# Altium schematic sheet Audio_module.SchDoc
size A4
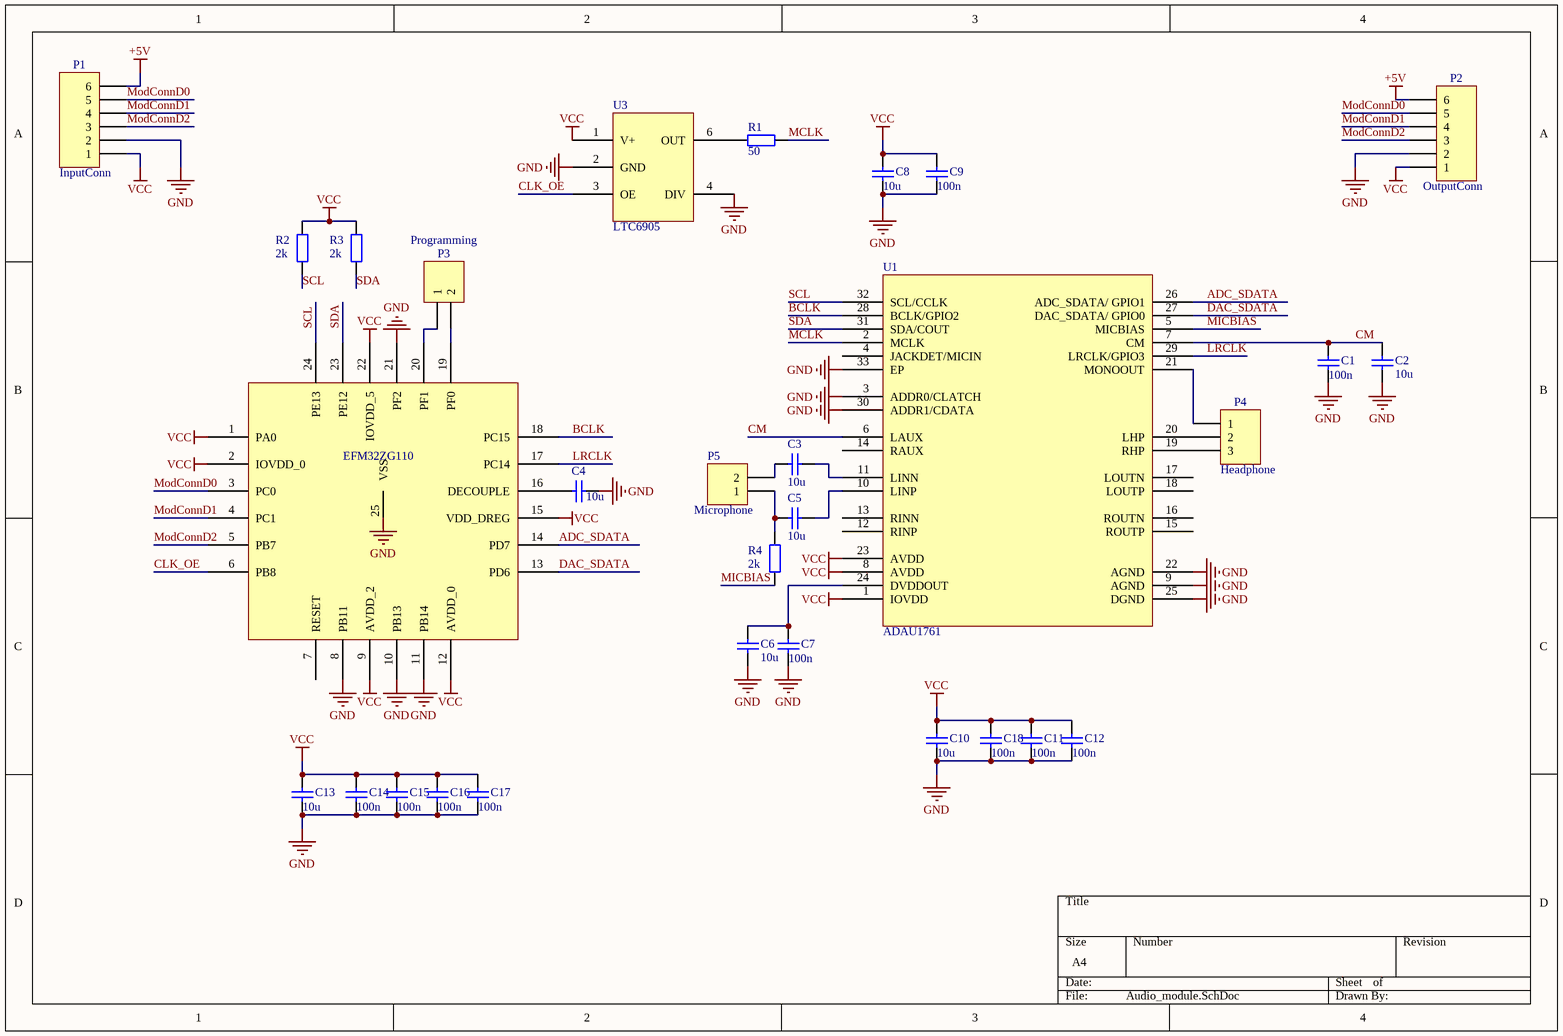
[diagram p0: Audio_module.SchDoc]

## Parts
C1  value 100n  [0402]  (hidden comment: Cap Semi)
C2  10u  [0805]
C3  10u  [0805]
C4  10u  [0805]
C5  10u  [0805]
C6  10u  [0805]
C7  value 100n  [0402]  (hidden comment: Cap Semi)
C8  10u  [0805]
C9  value 100n  [0402]  (hidden comment: Cap Semi)
C10  10u  [0805]
C11  value 100n  [0402]  (hidden comment: Cap Semi)
C12  value 100n  [0402]  (hidden comment: Cap Semi)
C13  10u  [0805]
C14  value 100n  [0402]  (hidden comment: Cap Semi)
C15  value 100n  [0402]  (hidden comment: Cap Semi)
C16  value 100n  [0402]  (hidden comment: Cap Semi)
C17  value 100n  [0402]  (hidden comment: Cap Semi)
C18  value 100n  [0402]  (hidden comment: Cap Semi)
P1  InputConn  [Goldpin6_1.27mm]
P2  OutputConn  [Goldpin6_1.27mm]
P3  Programming  [GeckoProgramming]
P4  Headphone  [3pinConnector]
P5  Microphone  [GeckoProgramming]
R1  value 50  [0402]  (hidden comment: Res2)
R2  value 2k  [0402]  (hidden comment: Res2)
R3  value 2k  [0402]  (hidden comment: Res2)
R4  value 2k  [0402]  (hidden comment: Res2)
U1  ADAU1761  [QFN32]
U2  EFM32ZG110  [QFN24_5x5_0.65]
U3  LTC6905  [SOT23-6_M]

## Nets
+5V: P1.6 P2.6
GND: C1.1 C2.1 C4.1 C6.1 C7.1 C8.1 C9.1 C10.1 C11.1 C12.1 C13.1 C14.1 C15.1 C16.1 C17.1 C18.1 P1.2 P2.2 U1.3(ADDR0/CLATCH) U1.9(AGND) U1.22(AGND) U1.25(DGND) U1.30(ADDR1/CDATA) U1.33(EP) U2.8(PB11) U2.10(PB13) U2.11(PB14) U2.21(PF2) U2.25(VSS) U3.2(GND) U3.4(DIV)
VCC: C8.2 C9.2 C10.2 C11.2 C12.2 C13.2 C14.2 C15.2 C16.2 C17.2 C18.2 P1.1 P2.1 R2.2 R3.2 U1.1(IOVDD) U1.8(AVDD) U1.23(AVDD) U2.1(PA0) U2.2(IOVDD_0) U2.9(AVDD_2) U2.12(AVDD_0) U2.15(VDD_DREG) U2.22(IOVDD_5) U3.1(V+)
ADC_SDATA: U1.26(ADC_SDATA/_GPIO1) U2.14(PD7)
BCLK: U1.28(BCLK/GPIO2) U2.18(PC15)
CLK_OE: U2.6(PB8) U3.3(OE)
CM: C1.2 C2.2 U1.6(LAUX) U1.7(CM)
DAC_SDATA: U1.27(DAC_SDATA/_GPIO0) U2.13(PD6)
LRCLK: U1.29(LRCLK/GPIO3) U2.17(PC14)
MCLK: R1.1 U1.2(MCLK)
MICBIAS: R4.1 U1.5(MICBIAS)
ModConnD0: P1.5 P2.5 U2.3(PC0)
ModConnD1: P1.4 P2.4 U2.4(PC1)
ModConnD2: P1.3 P2.3 U2.5(PB7)
SCL: R2.1 U1.32(SCL/CCLK) U2.24(PE13)
SDA: R3.1 U1.31(SDA/COUT) U2.23(PE12)
NetC3_1: C3.1 U1.11(LINN)
NetC3_2: C3.2 P5.2
NetC4_2: C4.2 U2.16(DECOUPLE)
NetC5_1: C5.1 U1.10(LINP)
NetC5_2: C5.2 P5.1 R4.2
NetC6_2: C6.2 C7.2 U1.24(DVDDOUT)
NetP3_1: P3.1 U2.20(PF1)
NetP3_2: P3.2 U2.19(PF0)
NetP4_1: P4.1 U1.21(MONOOUT)
NetP4_2: P4.2 U1.20(LHP)
NetP4_3: P4.3 U1.19(RHP)
NetR1_2: R1.2 U3.6(OUT)

Not connected (* = marked no-connect by the designer): U1 4(JACKDET/MICIN) 12(RINP) 13(RINN) 14(RAUX) 15(ROUTP) 16(ROUTN) 17(LOUTN) 18(LOUTP); U2 7(RESET)

## Library data of the parts
C1-C18 = Cap Semi: Capacitor (Semiconductor SIM Model); Published: 8-Jun-2000; LatestRevisionDate: 29-May-2009; LatestRevisionNote: IPC-7351 Footprint Added.; PackageReference: C1206; Publisher: Altium Limited; PackageDescription: Chip Capacitor
  C2-C6 C8 C10 C13: Value: 10u
P1 P2 = MHDR1X6: Header, 6-Pin; LatestRevisionDate: 17-Jul-2002; LatestRevisionNote: Re-released for DXP Platform.; Publisher: Altium Limited
P3 P5 = MHDR1X2: Header, 2-Pin; LatestRevisionDate: 17-Jul-2002; LatestRevisionNote: Re-released for DXP Platform.; Publisher: Altium Limited
P4 = Header 3: Header, 3-Pin; LatestRevisionDate: 17-Jul-2002; LatestRevisionNote: Re-released for DXP Platform.; Publisher: Altium Limited
R1-R4 = Res2: Resistor; Published: 8-Jun-2000; LatestRevisionDate: 17-Jul-2002; LatestRevisionNote: Re-released for DXP Platform.; PackageReference: AXIAL-0.4; Publisher: Altium Limited; PackageDescription: Axial Device, Thru-Hole; 2 Leads; 0.4 in Pin Spacing